# EAGLE board sensorboard_21 (EAGLE 9.6.0)
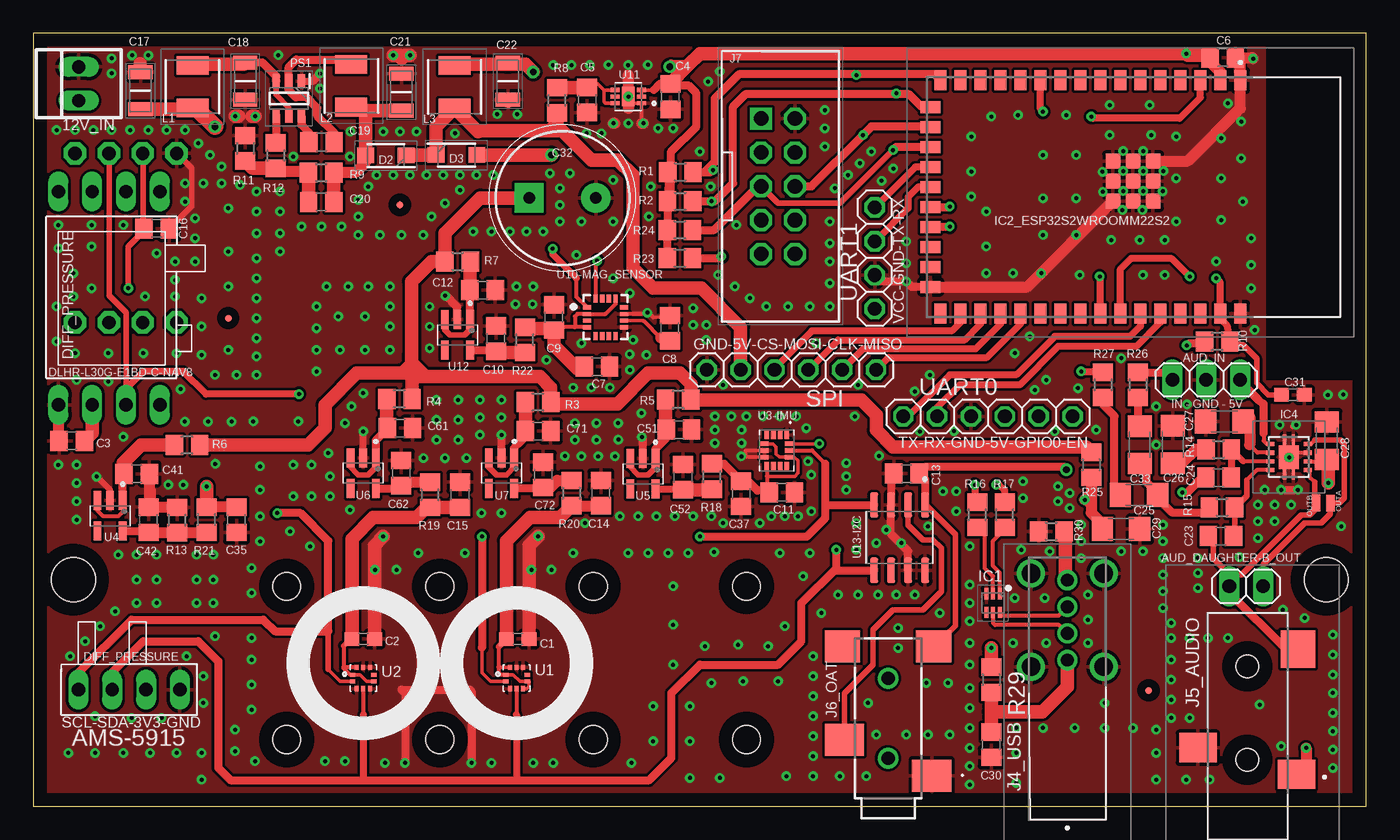
[diagram p1: board, top side]
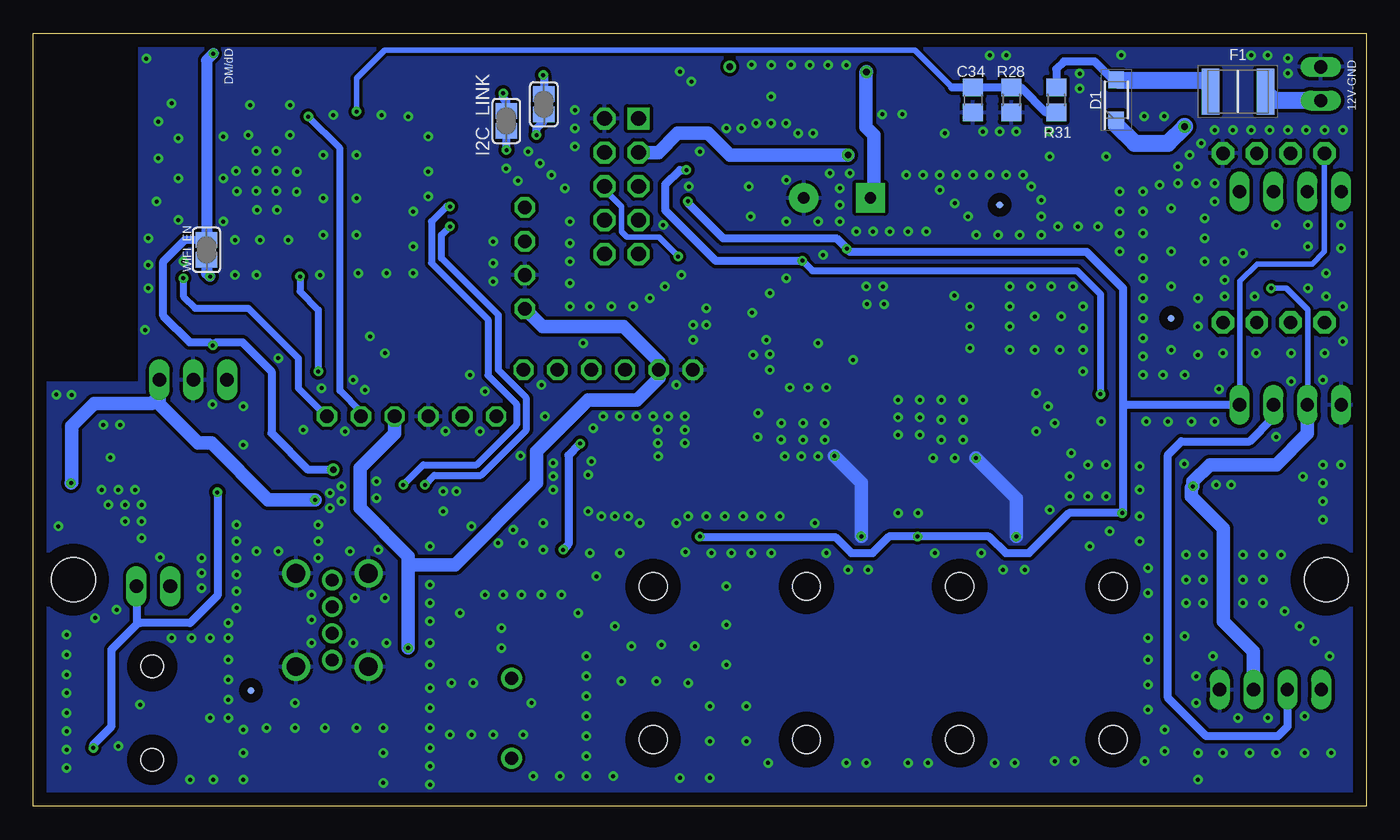
[diagram p2: board, bottom side, seen from below]

Size 100 x 58 mm. Coordinates in mm from the lower left corner, seen from the top.
Outline: 0,0 100,0 100,58 0,58 0,0
Copper layers (1*16): Top 0.035mm / dielectric 1.5mm / Bottom 0.035mm
Design rules "default *": minimum track width 10mil, minimum drill 24mil, track to track 0.149859375mm, track to pad 0.149859375mm, pad to pad 0.149859375mm, via to via 6mil, smd to smd 6mil, copper to edge 40mil, drill to drill 8mil, minimum pad ring 10mil, minimum via ring 8mil, stop-mask expansion 4mil, vias tented up to drill 0.45875mm, thermal gap 10mil
Holes 2.1 mm at 19,5 30.5,5 42,5 53.5,5 19,16.5 30.5,16.5 42,16.5 53.5,16.5
Holes 3.3 mm at 3,17 97,17

## Footprints (pad centres in the part's own frame; a part is rotated, then mirrored left to right if it is on the bottom)
22-23-2021 = drill 1 long: 1 -1.27,0; 2 1.27,0
1X02 = drill 1.016 long: 1 -1.27,0; 2 1.27,0
1X03 = drill 1.016 long: 1 -2.54,0; 2 0,0; 3 2.54,0
C0603 = smd 1.1 x 1: 1 -0.85,0; 2 0.85,0
C0805 = smd 1.3 x 1.5: 1 -0.95,0; 2 0.95,0
CAPC3216X180N = smd 1.05 x 1.82: 1 -1.39,0; 2 1.39,0
C1206 = smd 1.6 x 1.8: 1 -1.4,0; 2 1.4,0
CAPPRD500W65D1000H2200 = drill 0.85 pad 2.184 square: 1 0,0 | drill 0.85 pad 2.184: 2 5,0
SODFL3617X108N = smd 1.26 x 1.17: 1 -1.525,0; 2 1.525,0
DLHR-L30G-E1BD-C-NAV8 = drill 1 pad 1.422 long: 1-GND 0,0; 2-VS 0,-2.54; 3-SDA 0,-5.08; 4-SCL 0,-7.62; 5-EOC 16,-7.62; 6-MISO 16,-5.08; 7-NC 16,-2.54; 8-SS 16,0
FUSC4632X75N = smd 1.32 x 3.43: 1 -2.06,0; 2 2.06,0
FID_020_P = smd 0.508 x 0.508 bottom: FIDB 0,0 | smd 0.508 x 0.508: FIDT 0,0
SJ = smd 1.168 x 1.6: 1 -0.762,0; 2 0.762,0
SON50P150X170X55-6N = smd 0.85 x 0.3: 1 -0.7,0.5; 2 -0.7,0; 3 -0.7,-0.5; 4 0.7,-0.5; 5 0.7,0; 6 0.7,0.5
ESP32S2WROOMM22S2H3200PH3Q0 = smd 1.5 x 0.9: 1 -8.75,8; 2 -8.75,6.5; 3 -8.75,5; 4 -8.75,3.5; 5 -8.75,2; 6 -8.75,0.5; 7 -8.75,-1; 8 -8.75,-2.5; 9 -8.75,-4; 10 -8.75,-5.5; 11 -8.75,-7; 12 -8.75,-8.5; 13 -8.75,-10; 14 -8.75,-11.5; 15 -8.75,-13; 16 -8.75,-14.5; 27 8.75,-14.5; 28 8.75,-13; 29 8.75,-11.5; 30 8.75,-10; 31 8.75,-8.5; 32 8.75,-7; 33 8.75,-5.5; 34 8.75,-4; 35 8.75,-2.5; 36 8.75,-1; 37 8.75,0.5; 38 8.75,2; 39 8.75,3.5; 40 8.75,5; 41 8.75,6.5; 42 8.75,8 | smd 0.9 x 1.5: 17 -6.75,-15.25; 18 -5.25,-15.25; 19 -3.75,-15.25; 20 -2.25,-15.25; 21 -0.75,-15.25; 22 0.75,-15.25; 23 2.25,-15.25; 24 3.75,-15.25; 25 5.25,-15.25; 26 6.75,-15.25 | smd 1.1 x 1.1: 43 -1.19,-0.05; 44 -2.69,-0.05; 45 -2.69,-1.55; 46 -1.19,-1.55; 47 0.31,-1.55; 48 0.31,-0.05; 49 0.31,1.45; 50 -1.19,1.45; 51 -2.69,1.45
TPS7A8033DRBT = smd 0.6 x 0.31: 1 -1.4,0.975; 2 -1.4,0.325; 3 -1.4,-0.325; 4 -1.4,-0.975; 5 1.4,-0.975; 6 1.4,-0.325; 7 1.4,0.325; 8 1.4,0.975 | smd 1.5 x 1.75: 9 0,0 | smd 0.23 x 0.825: 10 -0.325,-1.278; 11 0.325,-1.278; 12 0.325,1.278; 13 -0.325,1.278
737250110BLF = drill 0.97 pad 1.509: 1 0,0; 2 0,2; 3 0,4; 4 0,6 | drill 1.4 pad 2.1: MH1 -2.72,6.5; MH2 2.72,6.5; MH3 2.72,-0.5; MH4 -2.72,-0.5
SJ3523SMTTR = smd 2.2 x 2.8: 1 2.4,-3.7; 3 4.4,3.7 | smd 2.8 x 2.6: 2 11.8,-3.8 | hole 1.7: 3.5,0; 10.5,0
SJ-2523-SMT-TR = smd 2.4 x 2.95: 1-S 1.7,-3.275; 3-R 4.4,3.275 | smd 2.4 x 2.65: 2-T 11.4,-3.425; 4 11.4,3.425 | drill 1 pad 1.55: 5 3,0; 6 9,0
SHDR10W64P254_2X5_2030X878X930 = drill 1.1 pad 1.65 square: 1 0,0 | drill 1.1 pad 1.65 octagon: 2 0,2.54; 3 2.54,0; 4 2.54,2.54; 5 5.08,0; 6 5.08,2.54; 7 7.62,0; 8 7.62,2.54; 9 10.16,0; 10 10.16,2.54
FDSD0420WH150MP3 = smd 1.4 x 2.4: 1 -1.6,0; 2 1.6,0
SMD2_SMALL = smd 1.27 x 0.635: 1 0,0
SOT95P280X90-6N = smd 1.05 x 0.55: 1 -1.3,0.95; 2 -1.3,0; 3 -1.3,-0.95; 4 1.3,-0.95; 5 1.3,0; 6 1.3,0.95
R0805 = smd 1.3 x 1.5: 1 -0.95,0; 2 0.95,0
1X06 = drill 1.016 octagon: 1 -6.35,0; 2 -3.81,0; 3 -1.27,0; 4 1.27,0; 5 3.81,0; 6 6.35,0
LGA10R50P2X3_200X200X80 = smd 0.4 x 0.3: 1 -0.8,0.25; 2 -0.8,-0.25; 6 0.8,-0.25; 7 0.8,0.25 | smd 0.3 x 0.4: 3 -0.5,-0.8; 4 0,-0.8; 5 0.5,-0.8; 8 0.5,0.8; 9 0,0.8; 10 -0.5,0.8
PQFN50P300X250X86-14N = smd 0.6 x 0.35: 1 -1.16,0.75; 2 -1.16,0.25; 3 -1.16,-0.25; 4 -1.16,-0.75; 8 1.16,-0.75; 9 1.16,-0.25; 10 1.16,0.25; 11 1.16,0.75 | smd 0.35 x 0.6: 5 -0.5,-0.91; 6 0,-0.91; 7 0.5,-0.91; 12 0.5,0.91; 13 0,0.91; 14 -0.5,0.91
SOP95P275X110-5N = smd 1.42 x 0.58: 1 -1.145,0.95; 2 -1.145,0; 3 -1.145,-0.95; 4 1.145,-0.95; 5 1.145,0.95
LGA16R50P4X4_330X330X100 = smd 0.61 x 0.32: 1 -1.395,0.75; 2 -1.395,0.25; 3 -1.395,-0.25; 4 -1.395,-0.75; 9 1.395,-0.75; 10 1.395,-0.25; 11 1.395,0.25; 12 1.395,0.75 | smd 0.32 x 0.61: 5 -0.75,-1.395; 6 -0.25,-1.395; 7 0.25,-1.395; 8 0.75,-1.395; 13 0.75,1.395; 14 0.25,1.395; 15 -0.25,1.395; 16 -0.75,1.395
SON50P200X200X80-7N = smd 0.74 x 0.32: 1 -0.985,0.5; 2 -0.985,0; 3 -0.985,-0.5; 4 0.985,-0.5; 5 0.985,0; 6 0.985,0.5 | smd 0.92 x 1.45: 7 0,0
SOIC127P600X175-8N = smd 1.9 x 0.6: 1 -2.455,1.905; 2 -2.455,0.635; 3 -2.455,-0.635; 4 -2.455,-1.905; 5 2.455,-1.905; 6 2.455,-0.635; 7 2.455,0.635; 8 2.455,1.905
AMS-5915 = drill 1 long: 1-GND 7.62,0; 2-VCC 5.08,0; 3-SDA 2.54,0; 4-SCL 0,0
4515DO-DS3BK030DPL_NO_SILK = drill 1 pad 1.676 octagon: 1-GND 0,0; 2-VS 0,-2.54; 3-SDA 0,-5.08; 4-SCL 0,-7.62; 5-INT/SS 12.7,-7.62; 6-NC 12.7,-5.08; 7-NC 12.7,-2.54; 8-NC 12.7,0
1X04 = drill 1.016 octagon: 1 -3.81,0; 2 -1.27,0; 3 1.27,0; 4 3.81,0

## Placement (x,y rotation side)
12V_IN  22-23-2021  [22-23-2021]  3.4,54.22 90 top
AUD_DAUGHTER-B_OUT  [1X02]  91,16.5 180 top
AUD_IN  [1X03]  88,32 0 top
C1  100nF  [C0603]  36.34,12.55 0 top
C2  100nF  [C0603]  24.75,12.54 0 top
C3  100nF  [C0805]  2.88,27.43 180 top
C4  10uF  [C0805]  47.79,53.25 270 top
C5  10uF  [C0805]  41.56,53 270 top
C6  1uF  [C0805]  89.23,56.18 0 top
C7  1uF  [C0805]  42.28,32.98 0 top
C8  10uF  [C0805]  47.75,35.87 90 top
C9  100nF  [C0805]  39.05,36.69 90 top
C10  10uF  [C0805]  34.7,35.1 90 top
C11  1uF  [C0805]  56.16,23.55 0 top
C12  10uF  [C0805]  33.71,38.72 0 top
C13  100nF  [C0805]  65.51,24.96 180 top
C14  1uF  [C0805]  42.58,23.5 90 top
C15  1uF  [C0805]  32.02,23.38 90 top
C16  100nF  [C0805]  9.24,43.35 0 top
C17  22uF/25V  [CAPC3216X180N]  8.04,53.7 270 top
C18  22uF/25V  [CAPC3216X180N]  15.9,54.41 90 top
C19  1uF  [C0805]  21.62,49.83 180 top
C20  47pF  [C0805]  21.6,45.34 180 top
C21  22uF/25V  [CAPC3216X180N]  27.62,53.57 270 top
C22  22uF/25V  [CAPC3216X180N]  35.6,54.4 90 top
C23  470pF  [C0805]  89.1,20.27 180 top
C24  470pF  [C0805]  88.92,24.66 180 top
C25  220nF  [C1206]  82.95,23.36 0 top
C26  220nF  [C1206]  85.5,27.15 270 top
C27  1uF  [C1206]  89.35,28.88 180 top
C28  1uF  [C1206]  97.05,27.43 90 top
C29  10uF  [C1206]  81.61,20.8 0 top
C30  1uF  [C0805]  71.88,4.62 270 top
C31  100nF  [C0603]  94.5,30.88 0 top
C32  EEU-FM1C102  [CAPPRD500W65D1000H2200]  37.2,45.65 0 top
C33  220nF  [C1206]  83,27.12 270 top
C34  1uF  [C0805]  29.5,53 270 bottom
C35  1uF  [C0805]  15.25,21.5 270 top
C37  100nF  [C0805]  53.11,23.45 270 top
C41  10uF  [C0805]  7.76,24.95 0 top
C42  10uF  [C0805]  8.64,21.5 90 top
C51  10uF  [C0805]  48.44,28.26 0 top
C52  10uF  [C0805]  48.74,24.69 90 top
C61  10uF  [C0805]  27.5,28.38 0 top
C62  10uF  [C0805]  27.6,25 90 top
C71  [C0805]  37.87,28.15 0 top
C72  10uF  [C0805]  38.25,24.88 90 top
D1  SS24FL  [SODFL3617X108N]  18.75,53 90 bottom
D2  SS24FL  [SODFL3617X108N]  26.45,48.84 180 top
D3  SS24FL  [SODFL3617X108N]  31.75,48.87 0 top
DLHR-L30G-E1BD-C-NAV8  DLHR-L30G-E1BD-C-NAV8  [DLHR-L30G-E1BD-C-NAV8]  1.88,30.12 90 top
F1  0ZCG0050AF2C  [FUSC4632X75N]  9.62,53.62 180 bottom
FD1  FID_20MIL_P  [FID_020_P]  14.62,36.62 0 top
FD2  FID_20MIL_P  [FID_020_P]  83.67,8.69 0 top
FD3  FID_20MIL_P  [FID_020_P]  27.5,45.12 0 top
I2C_LINK  [SJ]  61.7,52.67 270 bottom
IC1  ECMF02-2AMX6  [SON50P150X170X55-6N]  72,15.25 270 top
IC2_ESP32S2WROOMM22S2  ESP32-S2-WROOM_M22S2H3200PH3Q0  [ESP32S2WROOMM22S2H3200PH3Q0]  82.56,45.72 270 top
IC4  TPA6211A1DRBR  [TPS7A8033DRBT]  94.2,26.2 0 top
J4_USB  USB_CONN  [737250110BLF]  77.58,10.96 0 top
J5_AUDIO  SJ-3523-SMT-TR  [SJ3523SMTTR]  91.08,-0.01 90 top
J6_OAT  2.5mm JACK  [SJ-2523-SMT-TR]  64.12,0.6 90 top
J7  30310-6002HB  [SHDR10W64P254_2X5_2030X878X930]  54.6,51.6 270 top
L1  10uH  [FDSD0420WH150MP3]  11.94,53.99 90 top
L2  10uH  [FDSD0420WH150MP3]  23.85,54.05 270 top
L3  10uH  [FDSD0420WH150MP3]  31.6,53.98 90 top
OUTA  [SMD2_SMALL]  97.31,22.74 90 top
OUTB  [SMD2_SMALL]  96.25,22.75 90 top
PS1  AP65211AWU-7  [SOT95P280X90-6N]  19.17,53.12 270 top
R1  6k8  [R0805]  48.55,47.59 0 top
R2  6k8  [R0805]  48.53,45.39 0 top
R3  FERRITE  [R0805]  37.87,30.32 180 top
R4  FERRITE  [R0805]  27.47,30.57 180 top
R5  FERRITE  [R0805]  48.38,30.5 180 top
R6  FERRITE  [R0805]  11.53,27.1 180 top
R7  FERRITE  [R0805]  31.83,40.88 0 top
R8  FERRITE  [R0805]  39.29,52.97 90 top
R9  40k2  [R0805]  21.59,47.55 0 top
R10  10k  [R0805]  88.81,34.86 180 top
R11  7k68  [R0805]  15.91,49.37 270 top
R12  75k  [R0805]  18.19,48.82 270 top
R13  DNP  [R0805]  10.78,21.48 270 top
R14  10k  [R0805]  88.92,26.77 0 top
R15  [R0805]  89.17,22.43 0 top
R16  FERRITE  [R0805]  70.83,21.88 90 top
R17  FERRITE  [R0805]  72.88,21.88 90 top
R18  FERRITE  [R0805]  50.91,24.74 90 top
R19  FERRITE  [R0805]  29.75,23.38 270 top
R20  FERRITE  [R0805]  40.38,23.5 270 top
R21  FERRITE  [R0805]  13,21.5 90 top
R22  FERRITE  [R0805]  36.88,35 90 top
R23  6k8  [R0805]  48.5,41.12 0 top
R24  6k8  [R0805]  48.5,43.25 0 top
R25  FERRITE  [R0805]  79.38,25.62 270 top
R26  10k  [R0805]  82.88,31.62 270 top
R27  10k  [R0805]  80.25,31.62 270 top
R28  5k  [R0805]  26.62,53 270 bottom
R29  FERRITE  [R0805]  71.88,9.5 270 top
R30  FERRITE  [R0805]  76.38,20.62 0 top
R31  100k  [R0805]  23.25,53 270 bottom
SJ2-I2C  [SJ]  64.53,51.42 270 bottom
SPI  [1X06]  56.88,32.75 0 top
U1  LPS22HB  [LGA10R50P2X3_200X200X80]  36.25,9.62 0 top
U2  LPS22HB  [LGA10R50P2X3_200X200X80]  24.75,9.62 0 top
U3-IMU  LSM6DSMTR  [PQFN50P300X250X86-14N]  55.78,26.7 270 top
U4  NCV8163ASN330T1G  [SOP95P275X110-5N]  5.75,21.8 270 top
U5  NCV8163ASN330T1G  [SOP95P275X110-5N]  45.73,24.94 270 top
U6  NCV8163ASN330T1G  [SOP95P275X110-5N]  24.75,25 270 top
U7  NCV8163ASN330T1G  [SOP95P275X110-5N]  35.12,25 270 top
U10-MAG_SENSOR  MMC5983MA  [LGA16R50P4X4_330X330X100]  42.93,36.69 0 top
U11  LDL212PV33R  [SON50P200X200X80-7N]  44.64,53.25 180 top
U12  NCV8163ASN330T1G  [SOP95P275X110-5N]  31.82,35.38 270 top
U13-I2C  DS2482S-100+  [SOIC127P600X175-8N]  64.99,20.16 270 top
U$1  AMS-5915  [AMS-5915]  3.38,8.75 0 top
U$4  [4515DO-DS3BK030DPL_NO_SILK]  10.75,49 270 top
UART0  [1X06]  71.62,29.25 0 top
UART1  [1X04]  63.12,41.12 270 top
WIFI_EN  [SJ]  87,41.75 90 bottom

## Tracks (layer width: path | path; a pad name or v marks a point on that pad's centre or on a via)
3V3_DIG  (via drill 0.3, 0.5)
  Top 0.254: U11.3 U11.2 | 47.8,54.17 C4.1 | 47.81,54.2 C4.1 | 47.84,54.13 C4.1 | U11.3 45.7,53.75 | 46.55,53.75 U11.3 | C4.1 | 66.89,24.52 C13.1 66.48,24.98
  Top 0.406: U13-I2C.1 66.97,22.61 69.18,20.41 69.18,13.53 J6_OAT.2-T | C4.1 47.79,54.36 | 47,54.2 47.03,54.17
  Top 0.508: C13.1 66.96,25.46 | C4.1 47.89,54.1
  Top 0.61: C4.1 47,54.2 46.55,53.75 | 66.89,24.52 U13-I2C.1 | C6.1 88.05,56.18 | R2.1 47.82,45.41 47.82,49.07 49.75,51 49.75,53.5 49.15,54.1 47.89,54.1 | R1.1 47.69,47.58 R2.1 | R10.2 87.72,34.71 86.66,34.71 v86.53,34.58 | v77.5,25.25 77.29,25.46 66.96,25.46 | R2.1 47.59,43.28 R24.1 R23.1 | 47.79,54.36 47.83,54.4 | 47.03,54.17 47.8,54.17
  Top 0.813: IC2_ESP32S2WROOMM22S2.2 89.06,55.09 88.28,55.87 C6.1 | v47.75,55.5 47.87,55.62 49.13,55.62
  Top 1: 88.05,56.18 87.88,56.35 86.62,56.35 v86.5,56.48 v86.49,56.48 50,56.48 49.13,55.62 47.79,54.27 C4.1
  Bottom 0.61: WIFI_EN.2 88.61,42.51 90.25,40.88 90.25,36.8 88.28,34.83 86.78,34.83 v86.53,34.58 86.28,34.83 84.33,34.83 82.12,32.62 82.12,28 79.38,25.25 v77.5,25.25
  Bottom 0.813: v86.5,56.48 87,55.98 WIFI_EN.2
5V_AUD  (via drill 0.3)
  Top 0.305: IC4.1 92.55,27.18 92.3,27.43 92.3,27.99 | IC4.6 96.67,25.88
  Top 0.406: 97.28,25.88 | 97.09,26.07 C28.1 | 96.67,25.88 97.17,25.38 | 90.54,31.88 AUD_IN.3 91.92,30.62 91.92,30.49
  Top 0.61: 92.3,27.99 92.3,30.19 91.92,30.49 90.54,31.88 | 78.89,22.98 v78.88,23 79.38,22.5 79.38,22.02
  Top 0.813: C29.1 80.21,21.18 79.38,22.02 R25.2 79.38,23.47 78.89,22.98
  Top 1: 97.17,26 97.17,25.38 v97.17,24.25 | 97.28,25.88 97.17,26 | 97.17,26 97.09,26.07
  Bottom 1: v97.17,24.25 97.12,24.29 97.12,28.53 95.44,30.21 91.11,30.21
  Bottom 1.016: 91.11,30.21 90.54,30.79 AUD_IN.3 90.54,30.16 87.62,27.25 86.62,27.25 82.38,23 v78.88,23
5V_EXT  (via drill 0.5)
  Top 1.016: D3.2 38.87,48.87 v38.88,48.88
  Bottom 1.016: J7.3 53.1,49.06 51.66,50.5 49.38,50.5 47.75,48.88 v38.88,48.88
5VC  (via drill 0.5)
  Top 0.406: 30.88,32.25 29.75,32.25 | 28.38,33.51 28.38,33.88
  Top 0.508: 29.75,32.25 28.38,33.62 | 27.38,32.5 28.38,33.51
  Top 1.016: R25.1 78.98,26.96 64.51,26.96 63.25,28.23 63.25,29.38 62.12,30.5 R5.1 49.33,31.68 48.5,32.5 46.12,32.5 43.83,30.2 38.93,30.2 R3.1 38.81,31.43 38,32.25 30.88,32.25 28.42,32.25 | R4.1 28.42,32.25 | 28.38,32.5 28.38,33.62 28.38,33.88 28.38,39.38 29.88,40.88 R7.1 30.88,43.01 33.52,45.65 C32.1 | 28.42,32.25 28.42,32.5 28.38,32.5 | 28.38,32.5 27.38,32.5 24.25,32.5 21.88,30.12 21.88,28.38 20.6,27.1 R6.1 | 31.68,55.66 L3.2 31.68,55.66 35.48,55.66 C22.2 35.73,55.66 36.94,55.66 v37.5,55.1
  Bottom 1.016: C32.1 36.95,45.9 36.95,50.36 37.54,50.95 37.54,55.06 v37.5,55.1
5VD  (via drill 0.3)
  Top 1: 39.29,50.84 39.38,50.75 | 41.88,48.5 43.84,48.5 45,47.34 | 53.06,35.94 50.12,38.88 | 38.75,50.7 39.29,51.24 R8.1 | 33.35,50.62 L3.1
  Top 1.016: D2.1 28,48.87 D3.1 30.23,51.01 L3.1 33.27,50.7 38.75,50.7 39.67,50.7 41.88,48.5 | 50.12,38.88 46.5,38.88 45,40.38 45,47.34 | SPI.2 53.06,35.94 | R8.1 39.29,50.84 | v71.88,11.88 R29.1
  Bottom 1.016: 71.88,18.12 71.88,18.75 75.5,22.38 75.5,25.38 72.89,27.98 UART0.4 | 71.88,18.12 v71.88,11.88 | 71.88,18.12 68.38,18.12 62.25,24.25 62.25,26.62 58.38,30.5 54.69,30.5 53.06,32.12 SPI.2 53.06,33.31 55.74,35.99 61.8,35.99 UART1.4
AUD_IN
  Top 0.61: R26.1 82.95,32.5 84.96,32.5 AUD_IN.1
AUD_OUT_A  (via drill 0.3)
  Top 0.305: IC4.8 95.85,27.18 96.15,27.47
  Top 0.406: 87.67,24.66 C24.2 | 96.15,27.47 98.06,27.47 98.37,27.16 98.37,23.12 97.99,22.74 OUTA.1 97.31,21.93 96.62,21.25 95.38,21.25 92.27,18.14 AUD_DAUGHTER-B_OUT.1
  Top 0.61: v86.19,23.56 86.57,23.56 87.67,24.66
  Top 0.813: v95.5,4.38 95.5,3.11 J5_AUDIO.1
  Bottom 0.508: 92,13.75 92.25,14 92.25,16.48 | 86.14,23.5 v86.19,23.56
  Bottom 0.61: 92,13.75 88.25,13.75 86.14,15.86 86.14,23.5 | AUD_DAUGHTER-B_OUT.1 92.25,16.48 92.25,13.64 94.13,11.76 94.13,6 95.5,4.62 v95.5,4.38
AUD_OUT_B
  Top 0.305: IC4.5 95.72,25.1 95.72,24.73 96.12,24.32
  Top 0.406: 96.12,24.32 96.12,22.75 | 96.12,22.75 96.12,22.25 95.75,21.88 95.12,21.88 90.62,17.38 90,17.38 89.74,17.12 89.74,16.76 AUD_DAUGHTER-B_OUT.2 89.73,17.39 88.53,18.6 88.53,19.9 C23.2 | OUTB.1 96.12,22.75
  Top 0.61: J5_AUDIO.2 93.96,11.79 89.74,16.01 89.74,16.76
D+
  Top 0.305: IC1.6 72.5,14.43 72.62,14.3 76.92,14.3 J4_USB.3
D-
  Top 0.305: IC1.5 72,13.75 72.16,13.59 76.95,13.59 J4_USB.2
EN  (via drill 0.3)
  Top 0.406: R10.1 90,34.63 90.75,34.63 91.78,33.6 91.78,31.75 92.65,30.88 C31.1
  Top 0.508: R10.1 89.53,36.1 89.06,36.56 IC2_ESP32S2WROOMM22S2.41 89,37.03 89,39.38 v88.75,39.62
  Bottom 0.508: v88.75,39.62 88.75,38.25 87.88,37.38 83.88,37.38 80.12,33.62 80.12,31.38 78,29.25 UART0.6
ESP_AUD  (via drill 0.3)
  Top 0.508: IC2_ESP32S2WROOMM22S2.35 80.06,39.69 v80,39.75 | v78.62,32.62 80.2,32.62 R27.1
  Top 0.61: R27.1 80.58,32.58
  Bottom 0.508: v80,39.75 80,38.62 78.62,37.25 v78.62,32.62
FSPICLK
  Top 0.508: SPI.5 62.27,34.34 70.72,34.34 72.56,36.19 IC2_ESP32S2WROOMM22S2.30
FSPICS0
  Top 0.508: IC2_ESP32S2WROOMM22S2.28 69.56,36.31 68.91,35.66 58.4,35.66 55.6,32.86 SPI.3
FSPID_MOSI
  Top 0.508: SPI.4 60.4,35 69.88,35 71.06,36.19 IC2_ESP32S2WROOMM22S2.29
FSPIQ_MISO
  Top 0.508: SPI.6 63.25,32.75 64.17,33.67 71.55,33.67 74.06,36.19 IC2_ESP32S2WROOMM22S2.31
GND  (via drill 0.3, 0.3 pad 0.6)
  Top 0.254: 44.64,55.02 44.64,54.89 44.63,54.4 | 44.63,54.4 44.62,54.03 | 44.63,54.4 44.63,54.35 | 44.83,34.01 v44.73,33.92 | 45.64,51.28 45.64,52.73 U11.1 44.68,52.75 44.64,52.71 | 46.5,36.69 47.4,36.69 | 47.51,36.58 C8.2 | U13-I2C.3 64.37,22.62 | U3-IMU.1 56.53,27.98 | U3-IMU.6 53.43,26.7 53.43,26.2 U3-IMU.7
  Top 0.305: IC4.7 94.54,26.52 94.53,26.52 IC4.9 | 46.5,36.69 46.25,36.94 U10-MAG_SENSOR.11
  Top 0.406: 94.54,26.52 94.17,26.15 | 94.5,28.5 94.62,28.5 v94.75,28.62 | U4.2 5.75,23.75 4.76,24.73 v4.75,24.73 | U$4.1-GND 11.88,47.88 11.88,45.03 C16.2 | C1.2 37.1,12.46 | IC2_ESP32S2WROOMM22S2.42 90.56,36.59 | 91.41,35.75 v91.62,35.75
  Top 0.508: 47.51,36.58 47.4,36.69 | PS1.1 20.95,54.42 | U6.2 v24.75,28.12
  Top 0.61: 8.96,22.45 C42.2 | U13-I2C.7 65.62,19.14 64.36,20.41 U13-I2C.3 | 64.37,22.62 64.37,24.5 64.56,24.69 C13.2 | v21.5,54.98 20.95,54.42 | v93.62,23.75 v94.88,23.75 | 47.54,37.03 C8.2 | U7.2 v35.12,27.88 | U5.2 45.73,27.64 v45.66,27.7 | U12.2 31.81,37.47 30.97,38.3 v30.91,38.3 | v27.88,3.25 27.88,8.5 27.62,8.75 32.75,8.75 32.88,8.62 v32.88,3.25 | IC2_ESP32S2WROOMM22S2.26 65.91,38.97 v65.5,39.38 63.16,39.38
  Top 0.813: U11.7 44.64,54.89 | 44.64,52.71 44.64,52.38 | 43.64,51.25 v43.52,51.25 | 45.64,51.25 v45.77,51.25 | 41.64,52.05 C5.2 | C4.2 47.75,52.3 | IC2_ESP32S2WROOMM22S2.51 86.6,48.41 90.56,52.37 IC2_ESP32S2WROOMM22S2.1 90.56,55.8 C6.2 91.44,56.18 v91.53,56.1 | IC2_ESP32S2WROOMM22S2.26 74.57,38.97 IC2_ESP32S2WROOMM22S2.47 | C41.2 8.71,22.51 | C42.2 10.76,22.45 | 8.77,23.7 8.77,22.57 | DLHR-L30G-E1BD-C-NAV8.1-GND 1.88,27.48
  Top 1: 27.63,56.22 27.5,56.35 v27,56.35 | C21.1 | v28.25,56.35 27.89,56.35 27.62,56.09 | 8.03,55.72 8.03,55.1 C17.1 8.01,55.12 8.01,55.73 | 15.4,51.77 v15.15,51.77 | 16.4,51.77 v16.65,51.77 16.41,51.77 | C22.1 35.6,52.9
  Top 1.016: 8.71,22.51 C42.2 8.77,22.57 | 10.76,22.45 R13.1 | 1.88,27.48 C3.2 | C71.2 38.8,28.14 | C2.2 25.6,19.57 v26.25,20.23 | C1.2 37.2,19.57 v37.88,20.25 | 87.95,31.95 AUD_IN.2
  Bottom 0.254: v44.73,33.92 44.7,33.92
  Bottom 1.016: v26.25,20.23 26.25,23.09 v29.27,26.11 | v37.88,20.25 37.88,24.25 v39.89,26.27
  other vias: 43.14,55.64 46.1,55.64 53.13,27.25 37.45,37.67 11.25,24.11 46.08,37.03 81.77,49.16 34.8,51.93 36.3,51.92 94.22,26.17 98.27,30.88 84.73,46.14 83.27,46.16 81.77,46.16 81.72,44.73 80.22,47.61 83.27,49.16 84.8,47.67 83.27,47.66 81.77,47.66 80.25,46.12 83.22,44.73 93.12,22.62 94.38,22.62 93.12,21.38 93.5,28.62 7.4,56.34 8.63,56.35 58.13,25.88 91.88,22.62 91.88,21.38 91.88,20.12 92.38,23.75 26.38,3.25 34.38,3.25 35.12,22 33.62,22 25.62,17.75 37.38,17.75 46.75,21.75 45.38,21.75 74.25,24.38 76.88,24 79.75,28.25 86.56,30.15 84.25,30 97.12,30.88 87.38,18.62 87.38,17.5 87.38,16.38 78.62,19.88 78.62,21.12 81.62,19.12 77.75,23.5 76.25,19.12 77.75,22.38 74.12,19.25 67.25,32.38 75.88,15.62 84.75,18.62 84.75,17.38 84.75,16.12 84.75,14.88 86.75,12.62 85.38,13.75 85.38,12.62 85.38,11 85.38,9.5 85.38,8 86.75,6.62 23.38,3.38 21.88,3.38 37.5,3.25 39,3.25 1.75,50.75 3.12,50.75 4.5,50.75 5.88,50.75 7.25,50.75 8.62,50.75 10,50.75 11.38,50.75 12.38,49.75 13.25,48.88 14.12,48 14.12,46.75 26.25,50.62 27.5,50.62 28.75,50.62 18.38,56.38 5.88,56.12 5.88,55 41.5,50.5 48,50.88 51.5,55.12 50.62,54.38 59.38,52.25 59.38,50.88 59.38,49.5 60.12,46.38 61.12,47.38 62,48.25 62.88,49.12 63.64,46.93 64.52,47.86 59.75,43.88 59.75,42.25 59.75,40.88 59.75,39.25 52.75,43.62 49.5,37.38 49.5,36.12 51.75,31.62 58.25,37.5 59.75,37.5 73.62,34 74.75,35.25 38.75,47.5 40.25,47.5 34.5,47.38 33.25,47.38 32,47.38 30.75,47.38 29.5,47.38 28.25,47.38 43.5,47 25.75,47.38 24.38,45.5 24.38,44.25 43.5,43.88 41.12,43.88 39.5,43.88 40.75,41.38 29.73,34.37 29.73,35.99 29.73,37.49 40.5,31.42 41.88,31.42 43.25,31.42 44.75,32.75 53.5,29.25 54.75,29.25 56,29.25 51.12,29.25 40.62,28.75 42.25,28.75 43.88,28.75 45.62,29.5 43.62,26.25 42.38,26.25 23.75,22.25 13.66,25.7 17,25.5 16.5,28.88 19.88,28.88 19.5,25.62 20.88,25.62 24.75,31 23.88,30 23.38,28.75 22.12,26.5 13.62,32.38 15.25,32.38 16.75,32.38 14.87,28.86 13.12,28.86 11.37,28.86 11.04,31.3 5.62,31.88 6.75,27.72 3.25,32 1.88,25.62 3.25,25.62 12.25,18.88 13.5,18.88 12.25,15.25 13.5,15.25 13.5,17 12.25,17 9.25,18.88 9.25,17 9.25,15.25 13.62,12.75 7.75,18.88 7.75,17 7.75,15.25 8.38,38.25 10.62,38.25 10.62,39.5 11.38,46.75 12.75,46.75 11.38,45.38 12.12,44.12 12.12,42.62 12.12,40.88 10.62,40.88 6.75,43.62 4.38,43.62 4.38,42 4.38,38.88 5.62,34 8.25,34 10.75,34 3.12,34 3,38.25 1.88,43.62 7.38,6.62 9.62,6.62 27.25,17.75 38.88,17.75 56.38,21.75 55.38,21.75 54.5,21.25 51.75,21.25 50.88,21.75 49.5,21.75 48.12,21.75 44,21.75 41.38,21.25 65.12,19.75 67.12,21 64,20.75 61.75,21.25 61.75,19.25 66.12,15.88 68,14.5 64.75,15.88 63.38,15.88 61.88,15.88 60.38,15.88 59.12,14.5 58.25,19 58.38,22.12 58.38,24.88 56.62,37.5 70.25,19.5 70.25,16.62 70.25,15.25 70.25,13.88 70.25,12.25 73.5,12.25 75.75,5.88 76,12.25 79.12,15.88 79.12,14 79.12,12.25 70.25,10.62 70.25,8.88 58.5,11.25 58.5,9.75 58.5,8.25 58.5,6.75 58.5,5.25 58.5,3.75 58.5,2.25 56,19 51.09,19.07 49.12,19 47.62,19 46.12,19 44.62,19 98.12,21 84.25,27.12 16.75,33.75 16.75,35.12 16.75,36.62 16.75,38.12 16.75,39.62 16.75,41.12 16.75,43 16.75,44.62 16.75,46.12 15.5,46.62 18.5,46.12 18.5,44.62 18.5,43 20.12,43.5 21.62,43.5 23.12,43.5 26.75,39 25.12,39 23.62,39 22,39 26.75,37.5 26.75,36 26.75,34.25 24.88,34.25 23,34.25 21.25,34.25 21.25,35.88 21.25,37.5 21.25,32.62 30.25,30.5 31.88,30.5 33.5,30.5 35.12,30.5 30.88,26.12 32.5,26.12 33.5,27.88 30.25,29 30.25,27.5 22.25,23.25 20.88,23.25 19.5,23.25 22.25,24.75 17,23.75 17,21.75 17,19.88 16.38,17.88 16.38,16 16.38,12.62 16.38,11 16.38,9.12 16.38,7.25 15.12,5.75 15.12,4.12 12.62,4 12.62,2 16.62,3.38 10.75,4 8.75,4 12.75,9.75 12.75,7.75 49.25,7.5 49.25,4.88 46.5,4.88 46.5,7.5 50.38,12 55.12,12 56.38,13.5 48,10.62 50.88,9.25 53.25,9.38 55.88,9.38 57.75,17.25 52.38,29.25 93.75,14.75 95.38,14.12 97.5,12.88 97.5,11.38 92,7.62 97.5,8.5 97.5,9.88 97.5,7 97.5,5.62 93.62,4.5 97.5,4.25 97.5,2.88 88.25,2 86.5,2 84.25,2 84.25,4 84.25,5.75 85.38,6.62 88.12,12.62 89.62,12.62 70.25,7.38 70.25,5.88 70.25,4.38 70.25,3 70.25,1.62 64.88,13.38 64.88,11.88 62.62,7.75 68.62,9.25 67,9.25 63.25,5.38 60.5,2.25 62.5,2.25 68.75,5.38 67.12,5.38 65.5,5.38 49.25,2.12 44.88,3.25 52.88,12.12 40.5,19 28.88,19 19.25,20.62 20.75,19.5 32.38,19 65.5,40.75 66.5,28.12 61,24.75 55,37.5 58,28.38 57.25,29.25 51.38,39.88 52.62,39 46.31,46.5 39,55.62 40.38,55.62 41.75,55.62 29.25,42.88 27.62,42.88 26,42.88 24.38,42.88 29.88,44.25 30.88,45.25 32,46.25 39.5,46.38 39.5,45.12 9.25,41.5 3,40 1.88,41.88 1.75,37.5 1.75,34.88 25.12,46.5 27,47.38 24.88,36.75 22.88,36.75 18.5,41.62 12.62,33.88 12.62,36 12.62,38.12 33,43.12 34.38,43.12 35.75,43.12 37,43.12 38.25,43.12 43.5,39.62 44.75,38.5 46,33.88 70.38,45.75 71.5,44.62 75.75,42.88 71.5,42 71.5,40 41.12,26.25 51.12,28.25 43.89,27.52 40.62,27.5 35.12,29.18 31.88,27.5 37.5,39 36.25,39 36.17,37.67 44.62,55.62 44.64,51.25 42.62,50.5 46.88,50.88 21.5,53.85 53.12,26.25 51.12,27.25 41.12,34.75 6.75,4 4.62,4 2.62,4 11.5,11.25 6.12,14.62 5,13.5 3.88,12.38 2.75,11.25 3.25,24.25 3.25,22.88 3.25,21.5 6.38,18.88 10.12,24.12 14.62,44.88 14.62,41.62 14.62,39 14.62,34.25 66.12,31.12 61,23.75 63.25,19.75 76.88,22.88 4.62,6.75 48,13.62 48,16.5 56.5,2.25 51.5,2.12 73.75,4 73.75,5.88 78.12,5.88 80.38,5.88 82.5,5.88 89.62,52.75 91.38,38.88 91.38,40.62 91.38,42.62 89.12,44 89.12,47.12 89.12,50.12 85.75,43.88 84.88,39.88 84.88,42.5 85.75,47.12 85.75,50.25 73.5,40 75.62,40 78.5,39.88 83.25,39.88 70.38,50.25 70.38,47.62 71.88,51.75 73.88,51.88 77.5,51.88 80.75,50.38 83.88,50.38 90.75,45.38 90.62,48.62 90.62,51.38 50.5,36.12 31.62,50.5 31.88,29 33.5,29.18 42.25,27.5 73.75,1.75 73.62,15.62 45,35 38.5,33.5 90.49,18.68 44.64,53.26 84.75,21.12 76,32 75.12,31.25 78.38,31.38 84.75,19.88 65.5,42.38 76.62,28.12 68.25,23.62 69.25,23.62 53.75,38.12 58.75,34.75 50.5,35 81.62,33.62 78.25,45.62 75.75,45.62 88.75,40.88 78.25,48.88 75.75,48.88 74.25,23.12 78.25,42.88 83.75,52.62 80.75,52.62 83,42.5 80.88,42.5 50.81,46.5 50,49.12 46.19,44.25 61.88,31.62 19.5,48.75 23.75,48.75 23.8,50.63 69.25,22.12 78.62,18.62 83.25,19.12 80.38,7.75 57.38,21.75 53.13,28.25 61,25.75 61.62,29.25 63.45,26.29 69.08,28.14
  pour Bottom (isolate 0.254): 0,0 100,0 100,31.75 92,31.75 92,58 0,58
  pour Top (isolate 0.2): 0,58 92.38,58 92.38,31.88 99.88,31.88 99.88,0 0.25,0 0,-0.25
GPIO0  (via drill 0.3)
  Top 0.508: v79.38,51.75 79.5,51.62 86,51.62 87.56,53.19 IC2_ESP32S2WROOMM22S2.3
  Bottom 0.508: UART0.5 75.44,29.62 77,31.19 77,49.38 v79.38,51.75
IO
  Top 0.254: U13-I2C.2
  Top 0.406: U13-I2C.2 65.62,21.12 66.75,20 67.5,20 68.12,19.38 68.12,16.12 66.75,14.75 64.5,14.75 63,13.25 63,10.62 60.85,8.47 J6_OAT.3-R
N$2
  Top 0.254: U10-MAG_SENSOR.10 45.77,36.44 | C8.1 47.52,35.15
  Top 0.305: 45.77,36.44 47.06,35.15
  Top 0.813: 47.52,35.15 47.06,35.15
N$7
  Top 1.016: R29.2 71.88,7.08 | 71.88,7.08 C30.1 | 71.88,7.08 75.71,7.08 77.58,8.96 J4_USB.1
N$8
  Top 0.305: IC4.4 91.8,25.23 91.05,24.48
  Top 0.406: 91.05,24.48 91.05,23.3 90.17,22.43 R15.2 90.12,20.3 C23.1
N$9  (via drill 0.5)
  Top 1.016: L1.1 11.86,52.31 C17.2
  Top 1.27: v13.62,51 12.23,52.39 L1.1
  Bottom 1.27: D1.1 18.77,51.45 18.77,51.15 17.38,49.75 14.88,49.75 v13.62,51
N$13
  Top 0.406: PS1.3 18.22,53.38 19.17,52.43 PS1.5
  Top 0.61: PS1.3 18.22,54.78 17.2,55.8 C18.2
  Top 1.016: L1.2 12.03,55.67 15.78,55.67 C18.2
N$15
  Top 0.61: R15.1 87.85,22.05 85.4,22.05 84.35,23.1 C25.2 84.35,23.5 83.5,24.35 83.5,25.23 C33.2
N$16
  Top 0.813: 20.65,47.16 20.19,47.62 18.44,47.62 R12.2
  Top 1: R12.2 16.46,47.87 R11.2
  Top 1.016: 20.65,47.16 C20.2 R9.1
N$17
  Top 0.61: L2.1 23.48,56.03 19.73,56.03 19.17,55.47 PS1.2 19.17,53.73 19.7,53.2 20.5,53.2 21.3,52.4 21.3,51.8 22.57,50.53 C19.1
N$18
  Top 0.61: PS1.4 18.22,50.26 R12.1
N$20
  Top 0.61: PS1.6 20.12,51.13 20.67,50.58 C19.2
N$21
  Top 0.305: IC4.3 90.78,25.88
  Top 0.406: 90.78,25.88 R14.2
  Top 0.508: R14.2 C24.1
N$22
  Top 0.61: 86.19,25.75 C26.2
  Top 0.813: R14.1 87.21,26.77 86.19,25.75
N$23
  Top 1.016: J4_USB.4 77.42,17.12 77.42,20.53 R30.2
N$24
  Bottom 1.27: 12V_IN.1 6.88,52.95 F1.1
N$25  (via drill 0.3)
  Top 0.508: IC2_ESP32S2WROOMM22S2.36 81.56,40.31 82.38,41.12 85.38,41.12 v86.75,39.75
  Bottom 0.813: WIFI_EN.1 87,40 v86.75,39.75
N$26
  Top 0.305: 92.47,26.52 IC4.2 92.8,26.53 91.84,26.53 91.25,27.12
  Top 0.406: 90.75,28.25 C27.1
  Top 0.61: C27.1 91.12,29.25 91.25,29.25
  Top 0.813: 91.25,29.25 91.25,27.12
N$27
  Top 0.305: IC1.1 72.51,17.51 72,18.02 72,19.93 72.88,20.8 R17.1
N$28
  Top 0.305: IC1.2 72,17.25 71.36,17.89 71.36,20.39 R16.1
N$30
  Top 0.61: C25.1 81.12,23.79 81.12,29.27 80.25,30.15 R27.2
N$31
  Top 0.61: 82.8,30.59 R26.2 82.88,28.65 C33.1
N$33
  Top 0.508: D2.2 24.93,48.59
  Top 0.813: 24.9,52.07 24.52,52.45 L2.2 | D2.2 24.93,48.3 24.18,47.55 R9.2
  Top 1.016: R9.2 C20.1 | L2.2 24.48,52.45 24.73,52.2 27.59,52.2 C21.2 | 24.9,48.86 D2.2 24.93,52.05 24.52,52.45
N$34
  Bottom 0.61: D1.2 19.02,54.52 20.38,55.88 22.7,55.88 23.25,55.33 R31.1
  Bottom 1.27: F1.2 11.69,54 12.19,54.5 18.69,54.5 D1.2
SCL0  (via drill 0.3)
  Top 0.254: U3-IMU.13 56.9,26.7 | U1.2 34.3,9.37 33.66,10.01 33.66,11.88 | U2.2 23,9.38 22.12,10.25
  Top 0.305: U10-MAG_SENSOR.1 40.75,38.23 40.75,39.62 | 56.9,26.7 58.42,26.7 59.41,25.7
  Top 0.406: 22.12,10.25 22.12,13.12
  Top 0.508: 40.75,39.62 38.96,41.41 v38.96,41.83
  Top 0.61: R2.2 v50.88,45.39 51.14,45.39 52.5,46.75 52.5,52.5 53.43,53.43 64.68,53.43 v64.75,53.5 64.83,53.42 65.7,53.42 66.66,52.47 IC2_ESP32S2WROOMM22S2.17 | v50,20.24 58.04,20.24 59.41,21.61 59.41,22.61 | 59.41,22.61 U13-I2C.4 | 59.41,25.7 59.41,22.61 | v33.66,20.24 33.66,11.88 | v18.3,21.99 20.05,21.99 22.12,19.92 22.12,13.12 18.12,13.12 17.25,14 7.38,14 3.38,10 U$1.4-SCL
  Bottom 0.406: U$4.4-SCL 3.15,48.98 3.15,41.6 4.06,40.69 8.19,40.69 9.48,39.4 9.48,30.14 DLHR-L30G-E1BD-C-NAV8.4-SCL
  Bottom 0.61: SJ2-I2C.1 64.53,52.9 64.75,53.12 v64.75,53.5 | v50,20.24 49.96,20.2 39.84,20.2 38.62,18.99 37.04,18.99 35.79,20.24 v33.66,20.24 28.29,20.24 27.04,18.99 25.3,18.99 22.3,21.99 v18.3,21.99 18.24,21.99 18.24,29.99 | v50.88,45.39 50.88,45.26 48.25,42.62 39.76,42.62 v38.96,41.83 38.73,41.6 20.98,41.6 18.24,38.87 18.24,29.99 | DLHR-L30G-E1BD-C-NAV8.4-SCL 18.11,30.12 18.24,29.99
SCL1  (via drill 0.3)
  Top 0.406: J7.5 55.87,45.25 60.5,45.25 v64.5,49.25
  Top 0.61: IC2_ESP32S2WROOMM22S2.19 64.72,49.47 v64.5,49.25 | R24.2 51.08,43.25 54.35,46.52 J7.5
  Bottom 0.61: SJ2-I2C.2 64.53,49.27 v64.5,49.25
SDA0  (via drill 0.3)
  Top 0.254: U3-IMU.14 58.94,27.2 58.96,27.21
  Top 0.305: v42.3,40.94 42.18,40.81 U10-MAG_SENSOR.16 | U2.4 24.75,6.88 | U1.4 36.25,6.88
  Top 0.406: U$4.3-SDA 5.7,48.98 5.7,38.3 6.95,37.05 DLHR-L30G-E1BD-C-NAV8.3-SDA | v58.97,27.2 58.96,27.21 | v61.75,54.88 61.8,54.92 61.88,54.92
  Top 0.508: v19.93,30.92 12.95,30.92 11.25,32.62 8.25,32.62 6.96,31.33 DLHR-L30G-E1BD-C-NAV8.3-SDA | 36.25,6.88 36.25,1.96 | 24.75,6.88 24.75,1.96
  Top 0.61: IC2_ESP32S2WROOMM22S2.16 67.61,54.92 61.88,54.92 52.92,54.92 51.12,53.12 51.12,48.38 50.34,47.59 R1.2 50.84,47.59 v51,47.75 | U13-I2C.5 60.25,17.7 60.25,17.82 | 60.25,17.82 v60.25,19.25 | U$1.3-SDA 5.92,10.04 8.25,12.38 12.38,12.38 13.88,10.88 13.88,2.88 14.79,1.96 24.75,1.96 36.25,1.96 46.21,1.96 47.88,3.62 47.88,8.5 50,10.62 55.88,10.62 57.62,12.38 57.62,15.25 60.2,17.82 60.25,17.82
  Bottom 0.508: v42.3,40.94 41.55,40.19 21.7,40.19 19.93,38.42 v19.93,30.92
  Bottom 0.61: v61.75,54.88 61.7,54.83 I2C_LINK.1 | v60.25,19.25 59.84,19.66 59.84,26.33 v58.97,27.2 | v42.3,40.94 48.81,40.94 52.57,44.7 52.57,46.68 51.5,47.75 v51,47.75 | U$1.3-SDA 5.92,5.96 6.62,5.25 12,5.25 14.88,8.12 14.88,26.38 13.88,27.38 8.75,27.38 6.96,29.17 DLHR-L30G-E1BD-C-NAV8.3-SDA
SDA1  (via drill 0.3)
  Top 0.61: J7.6 58.4,46.52 v62.25,50.38 62.88,51 67.28,51 IC2_ESP32S2WROOMM22S2.18 | R23.2 51.5,41.12 v51.62,41.25
  Bottom 0.406: J7.6 57.14,46.27 55.87,45 55.87,43.12 55.47,42.72 53.05,42.72 51.62,41.3 v51.62,41.25
  Bottom 0.61: I2C_LINK.2 61.7,51.42 62.25,50.88 v62.25,50.38
U0RXD
  Top 0.508: IC2_ESP32S2WROOMM22S2.38 84.56,36.32 82.74,34.5 76.88,34.5 74,31.62 69.5,31.62 67.81,29.94 UART0.2
U0TXD
  Top 0.508: IC2_ESP32S2WROOMM22S2.37 83.06,36.02 82.28,35.25 76.62,35.25 73.75,32.38 68.75,32.38 65.62,29.25 UART0.1
U1RXD
  Top 0.508: IC2_ESP32S2WROOMM22S2.21 66.37,46.47 65.62,45.73 65.62,44.88 63.25,42.5 63.23,42.5 UART1.2
U1TXD
  Top 0.508: IC2_ESP32S2WROOMM22S2.20 66.17,47.97 63.13,44.94 UART1.1
USB_D+  (via drill 0.3)
  Top 0.508: v70.62,24.12 70.62,23.02 R16.2
  Top 0.61: IC2_ESP32S2WROOMM22S2.23 67.34,43.5 v68.75,43.5
  Bottom 0.508: v68.75,43.5 69.38,42.88 69.38,41.12 65.11,36.86 65.11,32.73 63,30.62 63,28.25 66.42,24.82 69.92,24.82 v70.62,24.12
USB_D-  (via drill 0.3)
  Top 0.508: v72.25,24.12 72.45,24.12 72.88,23.7 R17.2
  Top 0.61: IC2_ESP32S2WROOMM22S2.22 68.72,44.97 v68.75,45
  Bottom 0.508: v68.75,45 69,45 70.13,43.87 70.13,40.76 65.89,36.52 65.89,32.34 63.75,30.2 63.75,28.62 66.75,25.62 70.75,25.62 v72.25,24.12
V_SNS  (via drill 0.3)
  Top 0.508: v75.75,52.12 75.56,52.31 IC2_ESP32S2WROOMM22S2.11
  Bottom 0.406: v75.75,52.12 75.75,54.62 73.62,56.75 33.88,56.75 31.07,53.95
  Bottom 0.61: 31.07,53.95 C34.1 R28.1 25.92,53.95 24.02,52.05 R31.2
VDD1
  Top 0.254: U7.5
  Top 0.61: C72.1 38.19,23.86 U7.5
  Top 0.813: C72.1 38.8,23.93 39.33,24.45 R20.1
VDD1F
  Top 0.254: U1.10 34.9,10.43 | U1.5 37,8.82 37.18,9.01 37.18,9.38 U1.6 36.5,9.38 36,9.88 U1.1
  Top 0.305: 34.9,11.96 34.9,10.43 34.9,10.05 35.08,9.88 U1.1
  Top 0.406: C1.1 34.9,11.96
  Top 0.813: R20.2 C14.1
  Top 1.016: C1.1 35.49,19.92 37.25,21.68 39.5,21.68 R20.2
VDD1P
  Top 0.406: U7.1 36.08,25.45 35.5,24.88 34.75,24.88 34.12,25.5 34.12,26.09 U7.3 | 36.58,27.42 36.92,27.76 C71.1
  Top 0.61: U7.1 36.08,26.91 36.58,27.42 36.84,27.68
  Top 1.016: C71.1 R3.2
VDD2
  Top 0.61: U6.5 27.41,23.86 C62.1
  Top 0.813: R19.1 29.73,24.3 27.85,24.3 C62.1
VDD2F
  Top 0.254: U2.6 25,9.38 24.5,9.88 U2.1
  Top 0.305: 23.27,12.04 23.27,10.43 | 23.77,12.54 C2.1 | U2.10 23.27,10.43 | 23.27,10.43 23.27,10.35 23.75,9.88 U2.1
  Top 0.406: 23.77,12.54 23.27,12.04
  Top 1.016: C15.1 R19.2 29.5,22.43 28.75,21.68 25.5,21.68 23.9,20.07 C2.1
VDD2P
  Top 0.406: U6.1 25.7,25.45 25.12,24.88 24.38,24.88 23.75,25.5 23.75,26.09 U6.3
  Top 0.508: C61.1 26.36,28.57 26.36,28.8
  Top 0.61: U6.1 25.7,27.47 26.36,28.12 26.36,28.8 | R4.2 26.55,30.64
  Top 1.016: R4.2 26.52,28.41 C61.1
VDD3
  Top 0.254: 46.64,23.26 46.68,23.3 46.68,23.52
  Top 0.508: 48.69,23.8 U5.5 46.68,23.52
  Top 0.61: 48.69,23.8 C52.1
  Top 1.016: R18.1 50.86,23.74 C52.1
VDD3F
  Top 0.254: U3-IMU.5 55.48,27.2 55.72,26.96 55.72,26.44 55.97,26.2 U3-IMU.12 56.7,26.19 57.12,26.19 57.38,25.93 57.38,25 57.12,24.75 55.03,24.75
  Top 0.305: U3-IMU.8 55.03,24.75 55.03,23.73
  Top 0.406: 55.03,23.73 C11.1
  Top 0.61: R18.2 51.82,25.69 C37.1 53.61,24.4 54.33,23.68 55.08,23.68 C11.1
VDD3P
  Top 0.406: U5.1 46.68,25.43 46.12,24.88 45.38,24.88 44.75,25.5 44.75,26.05 U5.3
  Top 0.61: U5.1 46.68,26.8 47.5,27.62 47.5,28.25 C51.1
  Top 1.016: R5.2 47.42,28.32 47.5,28.25
VDD4
  Top 0.61: U4.5 8.54,20.66 8.66,20.52
  Top 0.813: 8.66,20.52 R13.2 12.97,20.52 R21.1
  Top 1.016: 8.66,20.52 C42.1
VDD4F  (via drill 0.3)
  Top 0.406: U$4.2-VS 8.23,48.98 8.23,43.42 | 8.23,43.42 8.21,43.44 8.21,43.06 7.12,41.98 v7.12,38.88 | 8.23,43.42 C16.1
  Top 0.813: C35.1 R21.2
  Top 1.016: DLHR-L30G-E1BD-C-NAV8.2-VS 4.42,28.01 C3.1 | R21.2 v13,24
  Bottom 0.406: DLHR-L30G-E1BD-C-NAV8.2-VS 4.4,30.14 4.4,37.27 6,38.88 v7.12,38.88
  Bottom 1.016: U$1.2-VCC 8.46,11.62 10.71,13.88 10.71,20.83 11.06,21.19 13.12,23.25 13.12,23.88 v13,24 13,24.36 11.73,25.62 6.75,25.62 4.42,27.96 DLHR-L30G-E1BD-C-NAV8.2-VS
VDD4P
  Top 0.305: U4.1 6.71,22.08 6.38,21.75 5.25,21.75 4.8,22.2 U4.3
  Top 0.61: U4.1 6.71,24.84 C41.1
  Top 1.016: R6.2 8.1,27.1 6.75,25.75 6.75,25.01 C41.1
VDD5
  Top 0.61: U12.5 34.62,34.23 C10.1
  Top 1.016: R22.1 34.8,34.05 C10.1
VDD5F
  Top 0.254: 41.47,32.84 C7.1
  Top 0.305: U10-MAG_SENSOR.4 40.62,35.94 | 40.62,35.94 39.26,35.94 C9.1 | 40.62,35.94 40.62,36.75 40.81,36.94 U10-MAG_SENSOR.2 42.93,36.94 43.68,37.7 U10-MAG_SENSOR.13
  Top 1.016: 41.47,32.84 40.78,32.84 39.05,34.58 C9.1 38.93,35.86 36.97,35.86 R22.2
VDD5P
  Top 0.406: U12.1 32.77,35.77 32.34,35.34 31.29,35.34 30.86,35.76 U12.3
  Top 0.61: U12.1 C12.1
  Top 1.016: C12.1 32.76,40.09 R7.2
VDD_DIGP
  Top 0.254: U11.4 42.8,53.75 | 42.8,53.75 42.34,54.21 41.82,54.21 | 41.82,54.21 41.57,54.21 | 41.82,54.21 41.62,54.01 C5.1 | U11.6 42.91,52.75 42.8,52.86 42.8,53.75
  Top 1: R8.2 39.33,53.96
  Top 1.016: R8.2 41.53,53.92 41.62,54.01

## Text on the board
tNames: VCC-GND-TX-RX | GND-5V-CS-MOSI-CLK-MISO | DLHR-L30G-E1BD-C-NAV8 | IN - GND - 5V | TX-RX-GND-5V-GPIO0-EN | SCL-SDA-3V3-GND | AMS-5915
bNames: DM/dD | 12V-GND